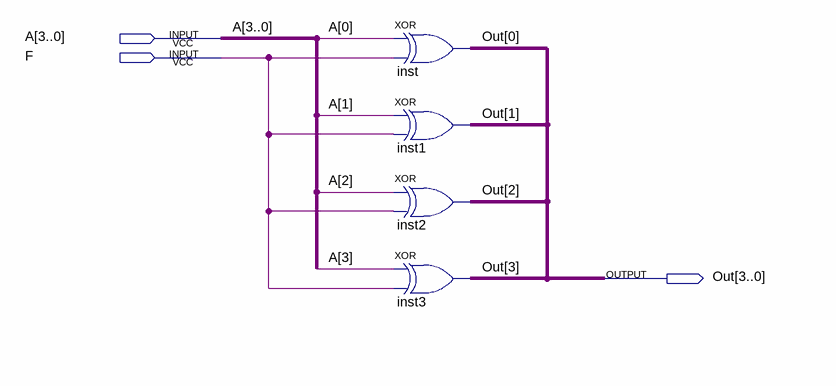
[diagram p0: schematic sheet]
// Quartus schematic inverter4.bdf as structural Verilog: 4 symbols, 3 pins
module inverter4 (
  input  [3:0] A,
  input  F,
  output [3:0] Out
);

  xor inst (Out[0], A[0], F);
  xor inst1 (Out[1], A[1], F);
  xor inst2 (Out[2], A[2], F);
  xor inst3 (Out[3], A[3], F);
endmodule
